# Altium project Anlog Project V1.PrjPcb
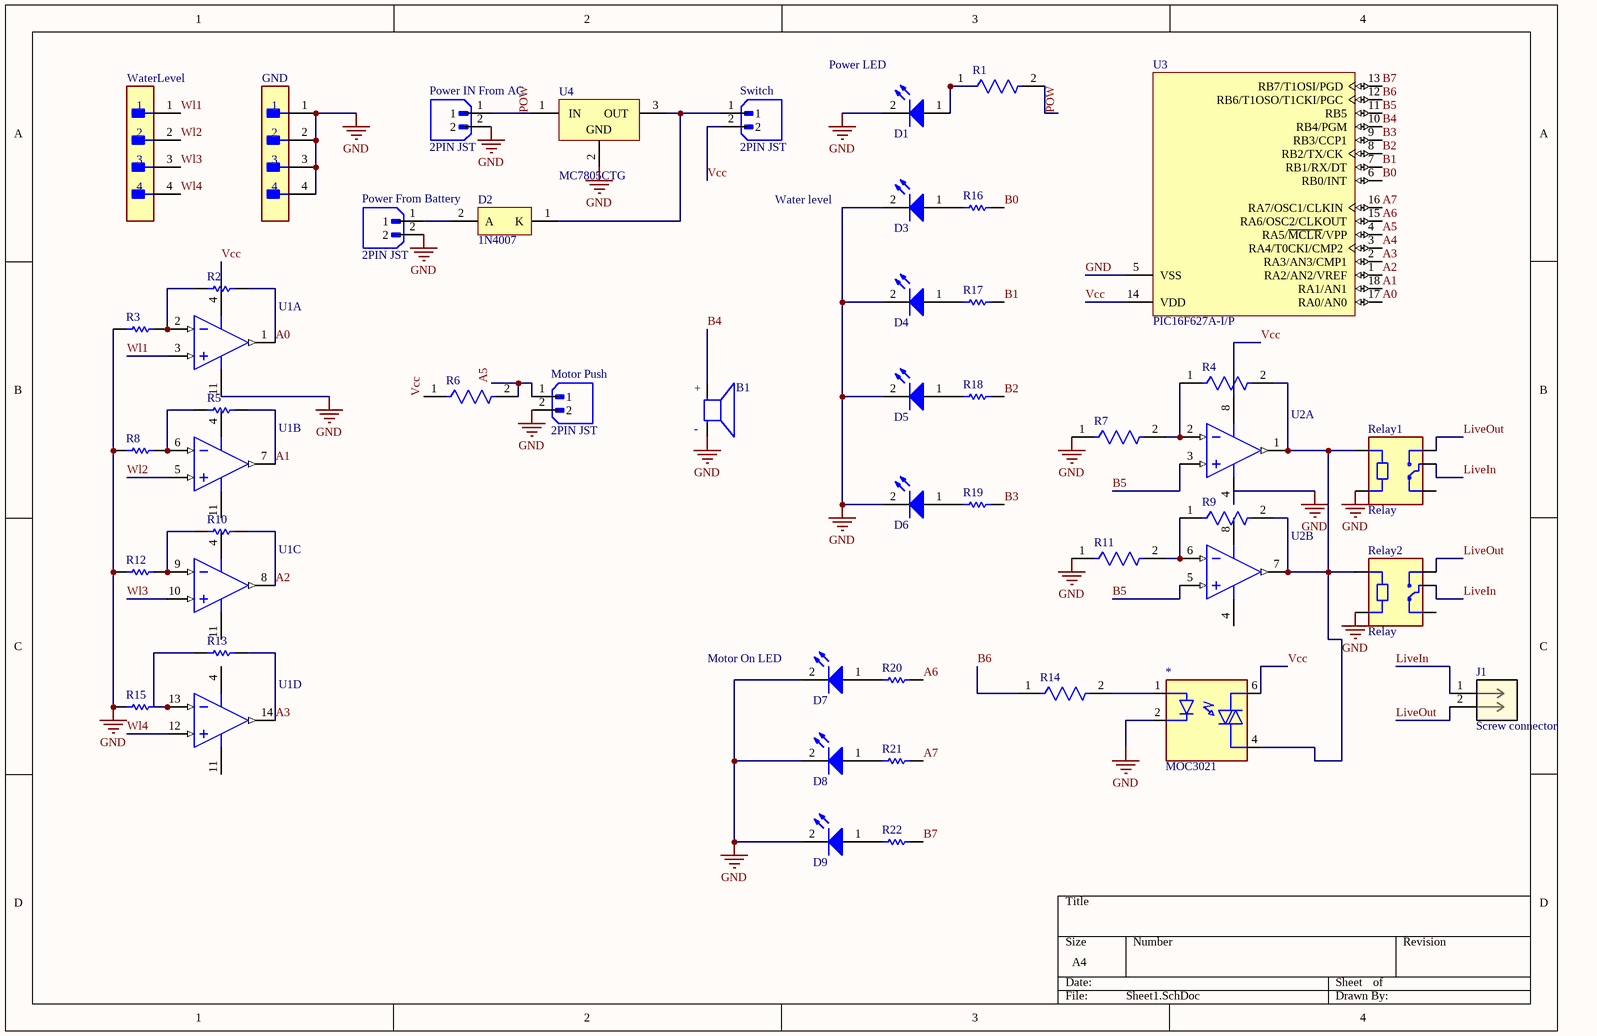
[diagram p0: Sheet1.SchDoc]
1 sheet, 46 parts. Net scope: global (net labels, ports and power ports of the same name join across sheets).
Board file: PCB1.PcbDoc

## Sheet Sheet1.SchDoc
size A4; SheetNumber: 1; SheetTotal: 1

### Parts
*  MOC3021  [MOC3021]
B1  Buzzer  [Buzzer]  (value not drawn)
D1  151051BS04000  [WL-TMRC_D5.9H8.7]  (value not drawn)
D2  1N4007  [ONSC-AXIAL_LEAD-2-59-10_P]
D3  151051BS04000  [WL-TMRC_D5.9H8.7]  (value not drawn)
D4  151051BS04000  [WL-TMRC_D5.9H8.7]  (value not drawn)
D5  151051BS04000  [WL-TMRC_D5.9H8.7]  (value not drawn)
D6  151051BS04000  [WL-TMRC_D5.9H8.7]  (value not drawn)
D7  151051BS04000  [WL-TMRC_D5.9H8.7]  (value not drawn)
D8  151051BS04000  [WL-TMRC_D5.9H8.7]  (value not drawn)
D9  151051BS04000  [WL-TMRC_D5.9H8.7]  (value not drawn)
GND  B4B-XH-A(LF)(SN)  [FP-B4B-XH-A_LF_SN-MFG]  (value not drawn)
J1  Screw connector  [Screw Connector]
Motor_Push  2PIN JST  [JST 2PIN]
Power_From_Battery  2PIN JST  [JST 2PIN]
Power_IN_From_AC  2PIN JST  [JST 2PIN]
R1  MRS25000C1001FCT00  [FP-MRS25-MFG]  (value not drawn)
R2  RC0805FR-071KL  [RESC2013X60X35ML10T20]  (value not drawn)
R3  RC0805FR-071KL  [RESC2013X60X35ML10T20]  (value not drawn)
R4  MRS25000C1001FCT00  [FP-MRS25-MFG]  (value not drawn)
R5  RC0805FR-071KL  [RESC2013X60X35ML10T20]  (value not drawn)
R6  MRS25000C1001FCT00  [FP-MRS25-MFG]  (value not drawn)
R7  MRS25000C1001FCT00  [FP-MRS25-MFG]  (value not drawn)
R8  RC0805FR-071KL  [RESC2013X60X35ML10T20]  (value not drawn)
R9  MRS25000C1001FCT00  [FP-MRS25-MFG]  (value not drawn)
R10  RC0805FR-071KL  [RESC2013X60X35ML10T20]  (value not drawn)
R11  MRS25000C1001FCT00  [FP-MRS25-MFG]  (value not drawn)
R12  RC0805FR-071KL  [RESC2013X60X35ML10T20]  (value not drawn)
R13  RC0805FR-071KL  [RESC2013X60X35ML10T20]  (value not drawn)
R14  MRS25000C1001FCT00  [FP-MRS25-MFG]  (value not drawn)
R15  RC0805FR-071KL  [RESC2013X60X35ML10T20]  (value not drawn)
R16  RC0805FR-071KL  [RESC2013X60X35ML10T20]  (value not drawn)
R17  RC0805FR-071KL  [RESC2013X60X35ML10T20]  (value not drawn)
R18  RC0805FR-071KL  [RESC2013X60X35ML10T20]  (value not drawn)
R19  RC0805FR-071KL  [RESC2013X60X35ML10T20]  (value not drawn)
R20  RC0805FR-071KL  [RESC2013X60X35ML10T20]  (value not drawn)
R21  RC0805FR-071KL  [RESC2013X60X35ML10T20]  (value not drawn)
R22  RC0805FR-071KL  [RESC2013X60X35ML10T20]  (value not drawn)
Relay1  Relay  [Relay]
Relay2  Relay  [Relay]
Switch  2PIN JST  [JST 2PIN]
U1  LMV324IDR  [D0014A_V]  (value not drawn)  (parts A,B,C,D of 4)
U2  LM358MX  [D0008A_M]  (value not drawn)  (parts A,B of 2)
U3  PIC16F627A-I/P  [PDIP300-P18]
U4  MC7805CTG  [ONSC-TO-220-3-221AB-01]
WaterLevel  B4B-XH-A(LF)(SN)  [FP-B4B-XH-A_LF_SN-MFG]  (value not drawn)

### Nets
GND: *.2(CATODE) B1.N D1.2(K) D3.2(K) D4.2(K) D5.2(K) D6.2(K) D7.2(K) D8.2(K) D9.2(K) GND.1 GND.2 GND.3 GND.4 Motor_Push.2 Power_From_Battery.2 Power_IN_From_AC.2 R3.1 R7.1 R8.1 R11.1 R12.1 R15.1 Relay1.A2 Relay2.A2 U1.11(GND) U2.4(GND) U3.5(VSS) U4.2(GND)
A0: R2.2 U1.1(1OUT) U3.17(RA0/AN0)
A1: R5.2 U1.7(2OUT) U3.18(RA1/AN1)
A2: R10.2 U1.8(3OUT) U3.1(RA2/AN2/VREF)
A3: R13.2 U1.14(4OUT) U3.2(RA3/AN3/CMP1)
A4: U3.3(RA4/T0CKI/CMP2)
A5: Motor_Push.1 R6.2 U3.4(RA5/~{MCLR}/VPP)
A6: R20.2 U3.15(RA6/OSC2/CLKOUT)
A7: R21.2 U3.16(RA7/OSC1/CLKIN)
B0: R16.2 U3.6(RB0/INT)
B1: R17.2 U3.7(RB1/RX/DT)
B2: R18.2 U3.8(RB2/TX/CK)
B3: R19.2 U3.9(RB3/CCP1)
B4: B1.P U3.10(RB4/PGM)
B5: U2.3(INA+) U2.5(INB+) U3.11(RB5)
B6: R14.1 U3.12(RB6/T1OSO/T1CKI/PGC)
B7: R22.2 U3.13(RB7/T1OSI/PGD)
LiveIn: J1.1 Relay1.COM Relay2.COM
LiveOut: J1.2 Relay1.NO Relay2.NO
POW: Power_IN_From_AC.1 R1.2 U4.1(IN)
Vcc: *.6(MAIN_TERM1) R6.1 Switch.2 U1.4(VCC+) U2.8(V+) U3.14(VDD)
Wl1: U1.3(1IN+) WaterLevel.1
Wl2: U1.5(2IN+) WaterLevel.2
Wl3: U1.10(3IN+) WaterLevel.3
Wl4: U1.12(4IN+) WaterLevel.4
Net*_1: *.1(ANODE) R14.2
Net*_4: *.4(MAIN_TERM2) R4.2 R9.2 Relay1.A1 Relay2.A1 U2.1(OUTA) U2.7(OUTB)
NetD1_1: D1.1(A) R1.1
NetD2_1: D2.1(K) Switch.1 U4.3(OUT)
NetD2_2: D2.2(A) Power_From_Battery.1
NetD3_1: D3.1(A) R16.1
NetD4_1: D4.1(A) R17.1
NetD5_1: D5.1(A) R18.1
NetD6_1: D6.1(A) R19.1
NetD7_1: D7.1(A) R20.1
NetD8_1: D8.1(A) R21.1
NetD9_1: D9.1(A) R22.1
NetR2_1: R2.1 R3.2 U1.2(1IN-)
NetR4_1: R4.1 R7.2 U2.2(INA-)
NetR5_1: R5.1 R8.2 U1.6(2IN-)
NetR9_1: R9.1 R11.2 U2.6(INB-)
NetR10_1: R10.1 R12.2 U1.9(3IN-)
NetR13_1: R13.1 R15.2 U1.13(4IN-)

Not connected (* = marked no-connect by the designer): Relay1 NC; Relay2 NC

### Notes on the sheet
- (near D1) Power LED
- Water level
- (near D7) Motor On LED
- (in symbol Buzzer) +; -

### Library data of the parts
D1 D3-D9 = CMP-1488-00009-2: NexarPartId: 29717812; Test Current: 20mA; Forward Voltage: 3.2V; Wavelength: 470nm; Lens Size: 5mm; Lens Style: Circular, Diffused, Round; Forward Current: 100mA; Peak Wavelength: 465nm; Viewing Angle: 40°; Luminous Intensity: 500mcd; Max Reverse Voltage (DC): 5V; Color: Blue; Case/Package: Radial; Width: 5mm; Mount: Through Hole; Min Operating Temperature: -40°C; Length: 5mm; Height: 8.6mm; Max Operating Temperature: 85°C; Packaging: Bulk; RoHS: Compliant; REACH SVHC: Unknown; Dominant Wavelength: 470nm
D2 = CMP-0902-00142-1: Standard Recovery Rectifier, 2-Pin Axial_Lead, Pb-Free, Bulk Bag; Manufacturer: On Semiconductor; IO(rec) Max (A): 1; IFSM Max (A): 30; VRRM Max (V): 1000; ComponentLink3URL: http://www.onsemi.cn/pub_link/Collateral/59-10.PDF; PackageVersion: Rev. U, 02/2005; PackageDescription: 2-Pin, Axial Lead, Diameter 2.35 mm; PackageReference: AXIAL_LEAD-2-59-10; RoHS: TRUE; PartNumber: 1N4007; Packing: Bulk Bag; DatasheetVersion: Rev. 13; ComponentLink3Description: Package Specification; ComponentLink1Description: Manufacturer URL; ComponentLink2URL: http://www.onsemi.com/pub_link/Collateral/1N4001-D.PDF; ComponentLink1URL: http://www.onsemi.com/; Type: Standard Recovery; ComponentLink2Description: Datasheet; Mounting Technology: Through Hole
GND WaterLevel = CMP-17439-000250-1: CONN HEADER VERT 4POS 2.5MM; Number of Contacts: 4; Contact Resistance: 20mR; Voltage Rating: 250V; Max Current Rating: 3A; Gender: Male; Wire/Cable Gauge: 22AWG; Mated Stacking Heights: 9.8mm; Insulation Resistance: 1GR; Orientation: Straight; Contact Type: Male Pin; Contact Finish - Mating: TIN; Series: XH; Max Voltage Rating (AC): 250V; Lead Pitch: 2.5mm; Contact Shape: Square; Insulation Color: Natural; Termination: Solder; Lead Free: Lead Free; Voltage Rating (AC): 250V; Number of Rows: 1; Flammability Rating: UL94 V-0; Number of Positions: 4; Max Operating Temperature: 85°C; Package Quantity: 500; Mount: Through Hole; REACH SVHC: No SVHC; Connector Type: Header; Insulation Material: Nylon; Fastening Type: Detent; Min Operating Temperature: -25°C; Housing Color: White; Packaging: Bulk; Contact Plating: Tin; Contact Material: Brass; Max Voltage Rating (DC): 250V; Housing Material: Polyamide; Color: Natural; Material: Polyamide; Pitch: 2.5mm; Depth: 5.75mm; Current Rating: 3A; Length: 12.4mm
R1 R4 R7 R9 R11 R14 = CMP-02408-000051-1: RES 1K OHM 0.6W 1% AXIAL; Power Rating: 600mW; Lead Diameter: 0.6mm; Voltage Rating (DC): 350V; Resistance: 1kR; Temperature Coefficient: 50ppm/°C; Width: 2.5mm; Military Standard: Not; Package Quantity: 5000; Radiation Hardening: No; Case/Package: Axial; Resistance Tolerance: 1%; Resistor Type: Metal Film; Contact Plating: Tin; Length: 6.5mm; Lead Free: Lead Free; RoHS Compliant: Yes; Mount: Through Hole; Number of Pins: 2; Technology: THIN FILM; Voltage Rating: 350V; Min Operating Temperature: -55°C; Weight: 0.00776oz; Diameter: 2.5mm; Construction: Cylindrical; Series: MRS25; Tolerance: 1%; Packaging: Tape and Reel; Max Operating Temperature: 155°C; Max Power Dissipation: 600mW; Number of Terminations: 2; Termination: Axial
R2 R3 R5 R8 R10 R12 R13 R15-R22 = CMP-2100-03671-1: Chip Resistor, 1 KOhm, +/- 1%, 125 mW, -55 to 155 degC, 0805 (2012 Metric), RoHS, Tape and Reel; Manufacturer: Yageo; Temperature Coefficient: 100ppm/degreesC; Voltage Rating (DC): 150V; Max Power Dissipation: 125mW; Resistance: 1KOhm; Number of Pins: 2; Number of Terminations: 2; Datasheet URL: http://www.yageo.com/NewPortal/yageodocoutput?fileName=/pdf/R-Chip/PYu-RC_Group_51_RoHS_L_5.pdf; Length: 0.079inch; Package Description: 2-Pin Surface Mounted Device, Body 2 x 1.25 mm; Depth: 1.25mm; Height: 0.024inch; Military Standard: Not; Case/Package: 0805; Package Reference: 0805; RoHSCompliant: true; Lead Free: LeadFree; Packaging: TapeandReel; Package Quantity: 1; Datasheet Version: Rev. 5, 10/2016; Tolerance: 1%; Min Operating Temperature: -55degC; Voltage Rating: 150V; Composition: ThickFilm; Case Code (Imperial): 0805; Power Rating: 125mW; Width: 0.049inch; Case Code (Metric): 2012; Manufacturer URL: http://www.yageo.com/; Max Operating Temperature: 155degC; REACH SVHC: Unknown; Termination: SMD/SMT
R6 = CMP-02408-000051-1: 100K; Power Rating: 600mW; Lead Diameter: 0.6mm; Resistance Tolerance: 1%; Voltage Rating (DC): 350V; Resistance: 1kR; Temperature Coefficient: 50ppm/°C; Width: 2.5mm; Military Standard: Not; Package Quantity: 5000; Radiation Hardening: No; Case/Package: Axial; Resistor Type: Metal Film; Contact Plating: Tin; Length: 6.5mm; Lead Free: Lead Free; RoHS Compliant: Yes; Mount: Through Hole; Number of Pins: 2; Technology: THIN FILM; Voltage Rating: 350V; Min Operating Temperature: -55°C; Weight: 0.00776oz; Diameter: 2.5mm; Construction: Cylindrical; Series: MRS25; Tolerance: 1%; Packaging: Tape and Reel; Max Operating Temperature: 155°C; Max Power Dissipation: 600mW; Number of Terminations: 2; Termination: Axial
U1 = CMP-1685-00010-1: Quad Low-Voltage Rail-to-Rail Output Operational Amplifier, 2.7 to 5.5 V, -40 to 125 degC, 14-Pin SOIC (D), Green (RoHS & no Sb/Br), Tape and Reel; ComponentLink3Description: Package Specification; ComponentLink2URL: http://www.ti.com/lit/ds/symlink/lmv324.pdf; ComponentLink3URL: http://www.ti.com/lit/ml/mpds177g/mpds177g.pdf; DatasheetVersion: SLOS263W, 10/2014; ComponentLink1URL: http://www.ti.com/; Code_JEDEC: MS-012; ComponentLink1Description: Manufacturer URL; PackageDescription: 14-Pin Small Outline Integrated Circuit, Body 8.65 x 3.9 mm, Pitch 1.27 mm; PackageReference: D0014A; ComponentLink2Description: Datasheet
U2 = CMP-0055-00630-3: Low Power Dual Operational Amplifier, 8-pin Narrow SOIC; Manufacturer: Texas Instruments; PowerWise: N; PackageTopMarking: NSZXTT*LM*358M; CompType: Amplifiers; ComponentLink1URL: http://www.ti.com/general/docs/lit/getliterature.tsp?genericPartNumber=LM358-N&fileType=pdf; PinCount: 8; PackageDescription: SOIC Narrow, 4.9 x 3.9 x 1.45mm, 8 Lead, 1.27mm Pitch; Code_IPC: SOIC127P600-8; RoHS: N; Code_JEDEC: MS-012-AA; Package Reference: D0008A; ComponentLink1Description: Datasheet URL
U3 = CMP-0115-00194-1: FLASH-Based 8-Bit CMOS Microcontroller with nanoWatt Technology, 1K (x14-Bit words) FLASH, 224 Bytes SRAM, 18-Pin PDIP, 3.0 to 5.5V Supply Range, Industrial Temperature; PackageVersion: revBB, Aug-2009; PackageDescription: 18-Lead Plastic Dual In-Line (P) - 300 mil Body [PDIP]; PackageReference: PDIP300-P18; Code_JEDEC: MS-001; DatasheetVersion: revF, Mar-2007
U4 = CMP-2000-04928-1: Positive Voltage Regulator, 1 A, 5 V, 0 to 125 degC, 3-Pin TO-220, RoHS, Tube; Manufacturer: ON Semiconductor; Resistance, Thermal, Junction to Case: 5degC/W; Voltage, Supply: 35V; Regulator Function: Standard; Temperature, Operating, Maximum: +125degC; Load Regulation: 25mV; Regulator Type: PositiveVoltageOut; Current, Output, Maximum: 1A; Regulation, Load: 1.3mV; Number of Outputs: 1; Temperature, Operating, Range: 0to+125degC; Regulation, Line: 0.5mV; Line Regulation: 20mV; Voltage, Input Range: Maximumof35V; Output Type: Fixed; Current, Quiescent Supply: 6.5mA; Dropout Voltage: 2V; Temperature, Operating, Minimum: 0degC; Package Version: Rev. A, 11/2010; Current, Supply: 3.2mA; Voltage, Output: 5V; Voltage, Noise: 10μV/V; Package Type: TO-220; Voltage, Input, High Level: 35V; Datasheet URL: http://www.onsemi.com/pub_link/Collateral/MC7800-D.PDF; Dimensions: 10.28x4.82x15.75mm; Width: 4.82mm; Type: VoltageRegulator; Mounting Type: ThroughHole; Polarity: Positive; Datasheet Version: Rev. 27, 11/2014; Height: 15.75mm; Dropout Voltage Measurement Current: 1A; Package Description: 3-Pin Flange Mount, Vertical Straight Lead, Body 9.97 x 4.445 mm, Pitch 2.54 mm; Manufacturer URL: http://www.onsemi.com/; Voltage, Dropout: 2V; Length: 10.28mm; Number of Pins: 3; Package Reference: TO-220-3-221AB-01